# EAGLE design Power_Schematic (EAGLE 6.5.0)
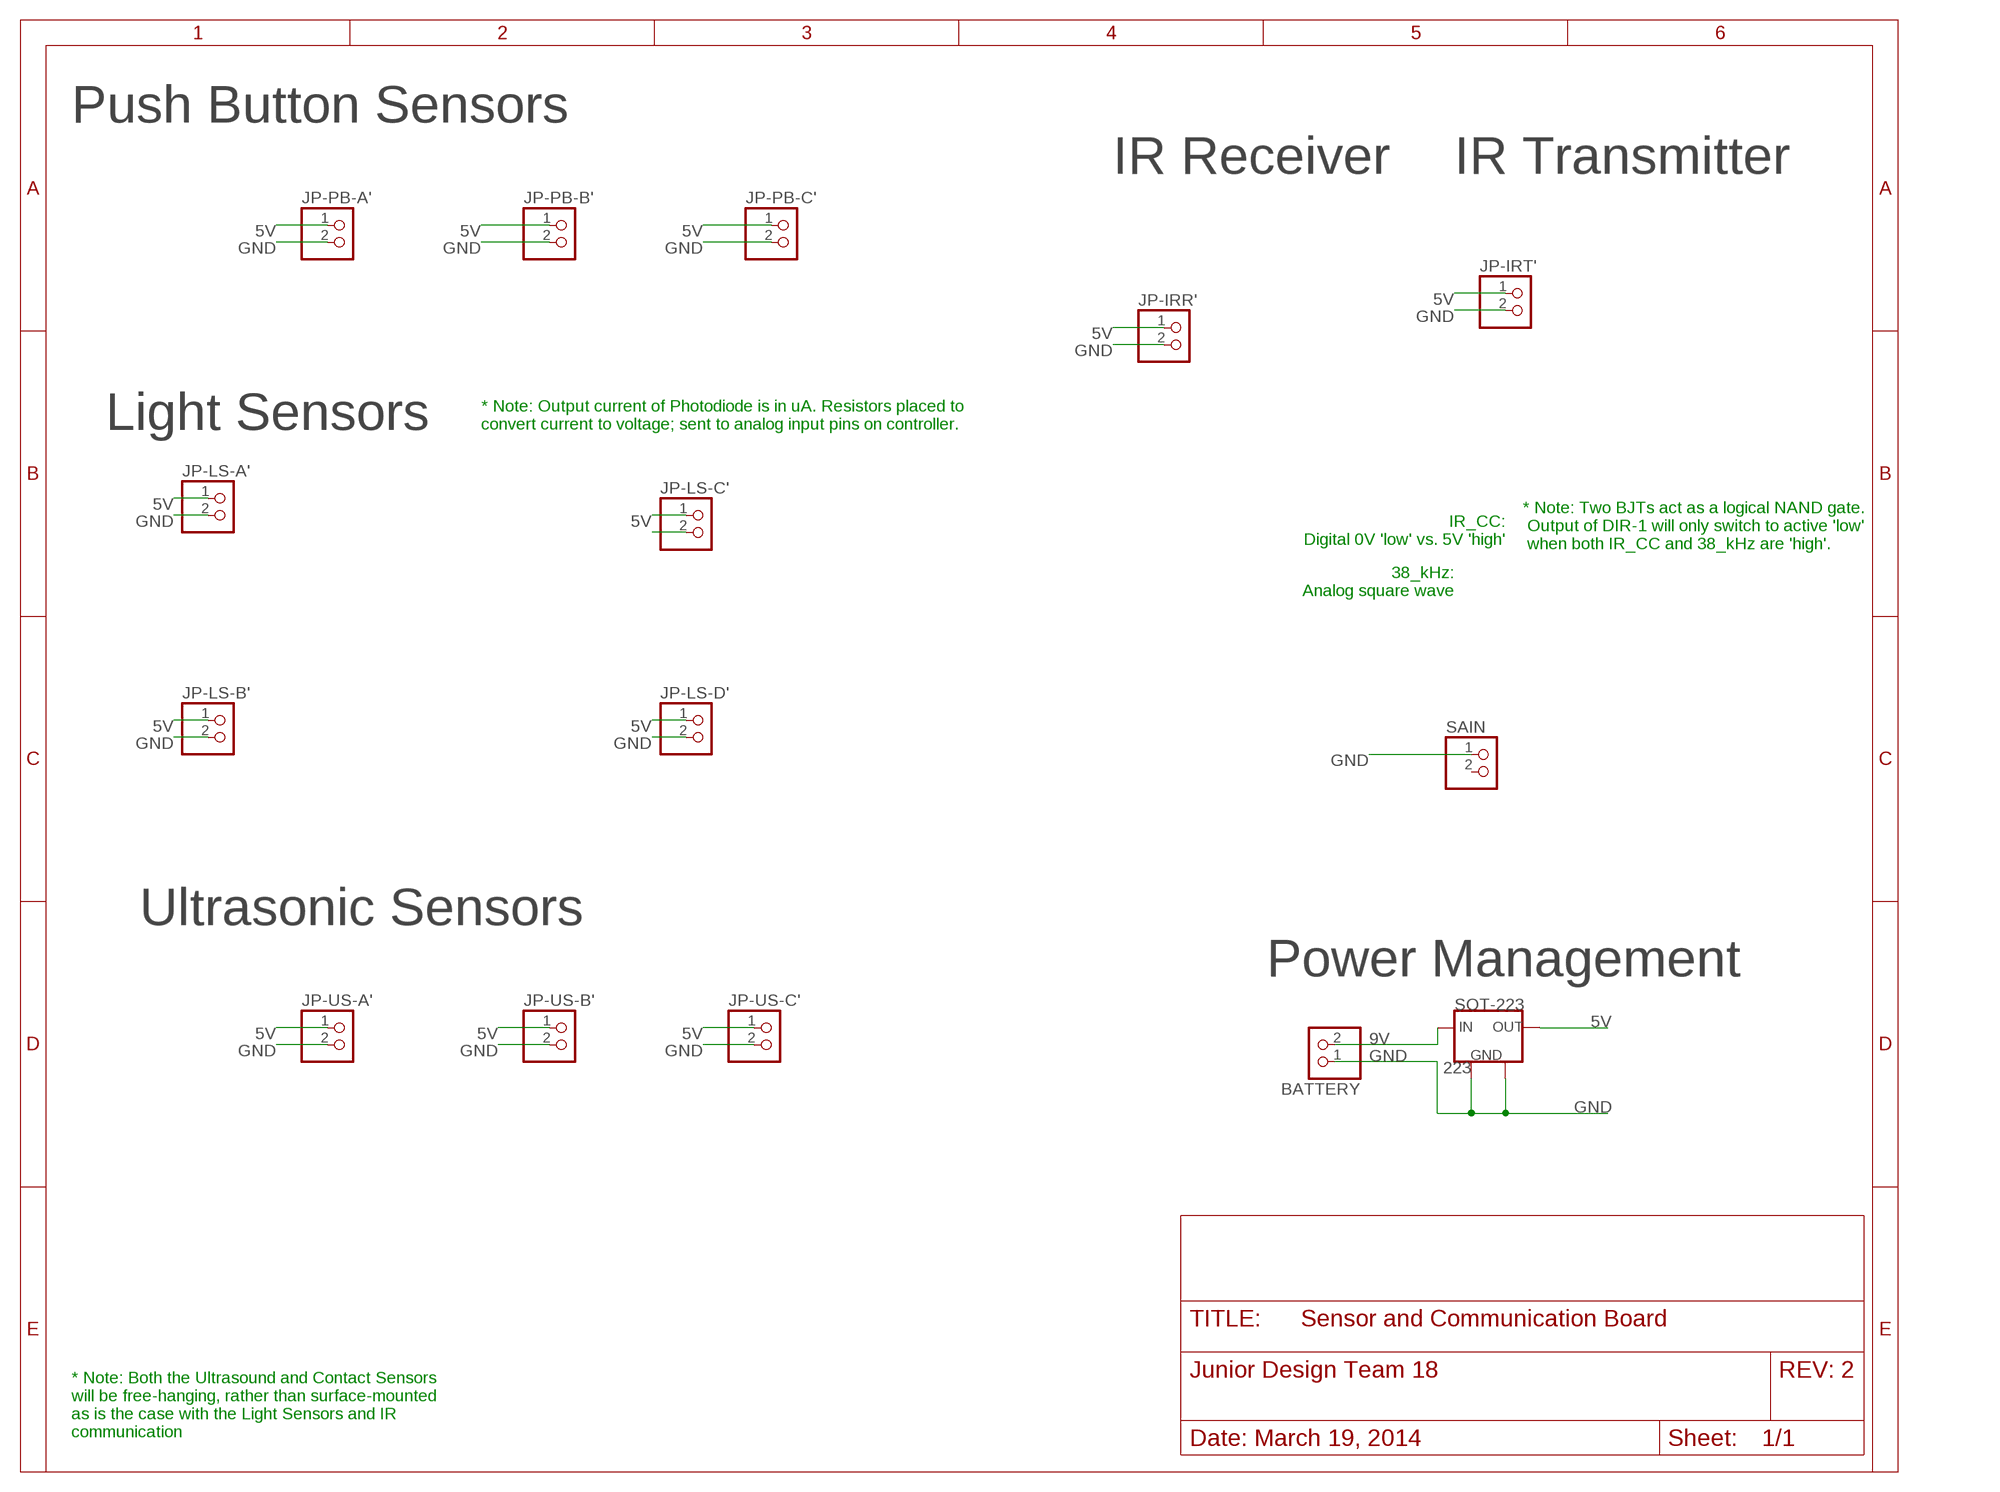
[diagram p0: schematic, sheet 1]

## Parts
BATTERY  PINHD-1X2  [1X02]
JP-IRR'  PINHD-1X2  [1X02]
JP-IRT'  PINHD-1X2  [1X02]
JP-LS-A'  PINHD-1X2  [1X02]
JP-LS-B'  PINHD-1X2  [1X02]
JP-LS-C'  PINHD-1X2  [1X02]
JP-LS-D'  PINHD-1X2  [1X02]
JP-PB-A'  PINHD-1X2  [1X02]
JP-PB-B'  PINHD-1X2  [1X02]
JP-PB-C'  PINHD-1X2  [1X02]
JP-US-A'  PINHD-1X2  [1X02]
JP-US-B'  PINHD-1X2  [1X02]
JP-US-C'  PINHD-1X2  [1X02]
SAIN  PINHD-1X2  [1X02]
SOT-223  223  V_REG_LM1117SOT223  [SOT223]

## Nets
5V: JP-IRR'.1 JP-IRT'.1 JP-LS-A'.1 JP-LS-B'.1 JP-LS-C'.1 JP-LS-D'.1 JP-PB-A'.1 JP-PB-B'.1 JP-PB-C'.1 JP-US-A'.1 JP-US-B'.1 JP-US-C'.1 SOT-223.GND1(OUT)
9V-BAT: BATTERY.2 SOT-223.OUT(IN)
GND: BATTERY.1 JP-IRR'.2 JP-IRT'.2 JP-LS-A'.2 JP-LS-B'.2 JP-LS-C'.2 JP-LS-D'.2 JP-PB-A'.2 JP-PB-B'.2 JP-PB-C'.2 JP-US-A'.2 JP-US-B'.2 JP-US-C'.2 SAIN.1 SOT-223.GND2(GND1) SOT-223.IN(GND2)
Unconnected: SAIN.2

## Notes on the sheet
- Push Button Sensors
- IR Receiver | IR Transmitter
- 5V | 5V | 5V
- GND | GND | GND
- 5V
- GND
- 5V
- GND
- Light Sensors
- * Note: Output current of Photodiode is in uA. Resistors placed to
  convert current to voltage; sent to analog input pins on controller.
- 5V
- GND | 5V
- IR_CC:
  Digital 0V 'low' vs. 5V 'high'
- * Note: Two BJTs act as a logical NAND gate.
   Output of DIR-1 will only switch to active 'low'
   when both IR_CC and 38_kHz are 'high'.
- 38_kHz:
  Analog square wave
- 5V | 5V
- GND | GND
- GND
- Ultrasonic Sensors
- Power Management
- 5V | 5V | 5V | 5V
- GND | GND | GND | 9V
- GND
- GND
- * Note: Both the Ultrasound and Contact Sensors
  will be free-hanging, rather than surface-mounted
  as is the case with the Light Sensors and IR
  communication

## Library data of the parts
BATTERY JP-IRR' JP-IRT' JP-LS-A' JP-LS-B' JP-LS-C' JP-LS-D' JP-PB-A' JP-PB-B' JP-PB-C' JP-US-A' JP-US-B' JP-US-C' SAIN = pinhead:PINHD-1X2: PIN HEADER
SOT-223 = JDT-18:V_REG_LM1117: Voltage Regulator LM1117 Standard adjustable voltage regulator but in SMD form. Spark Fun Electronics SKU : COM-00595

## Net classes
0 default: width 0.152 mm, drill 0.33 mm

## Board
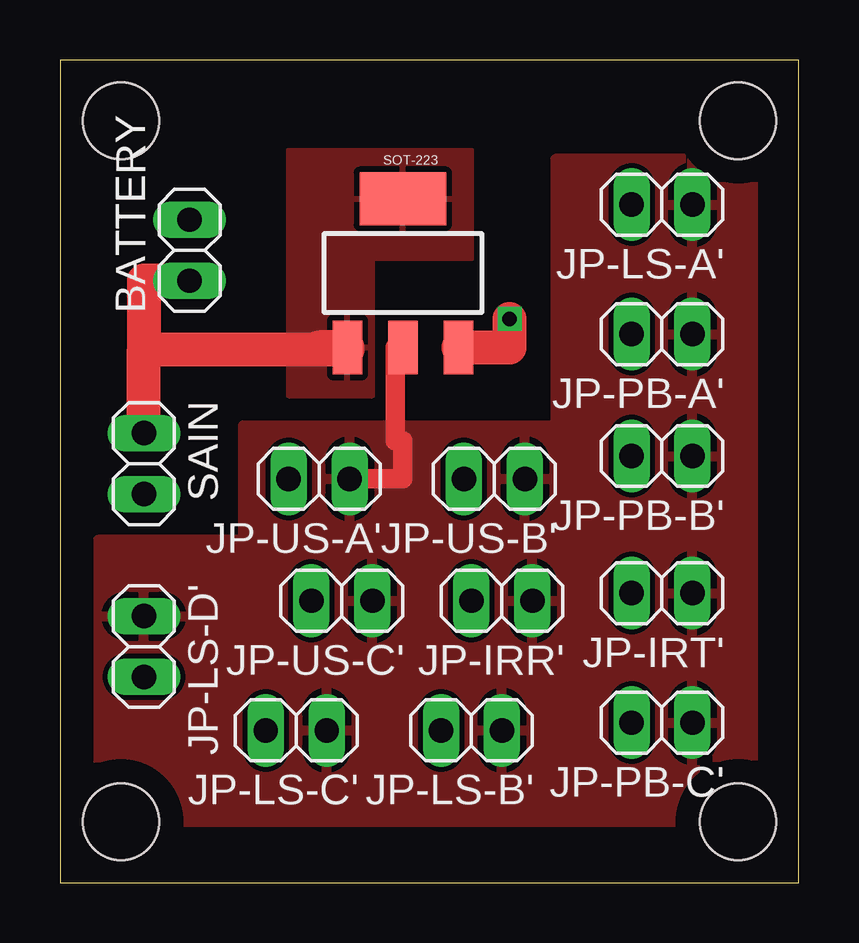
[diagram p1: board, top side]
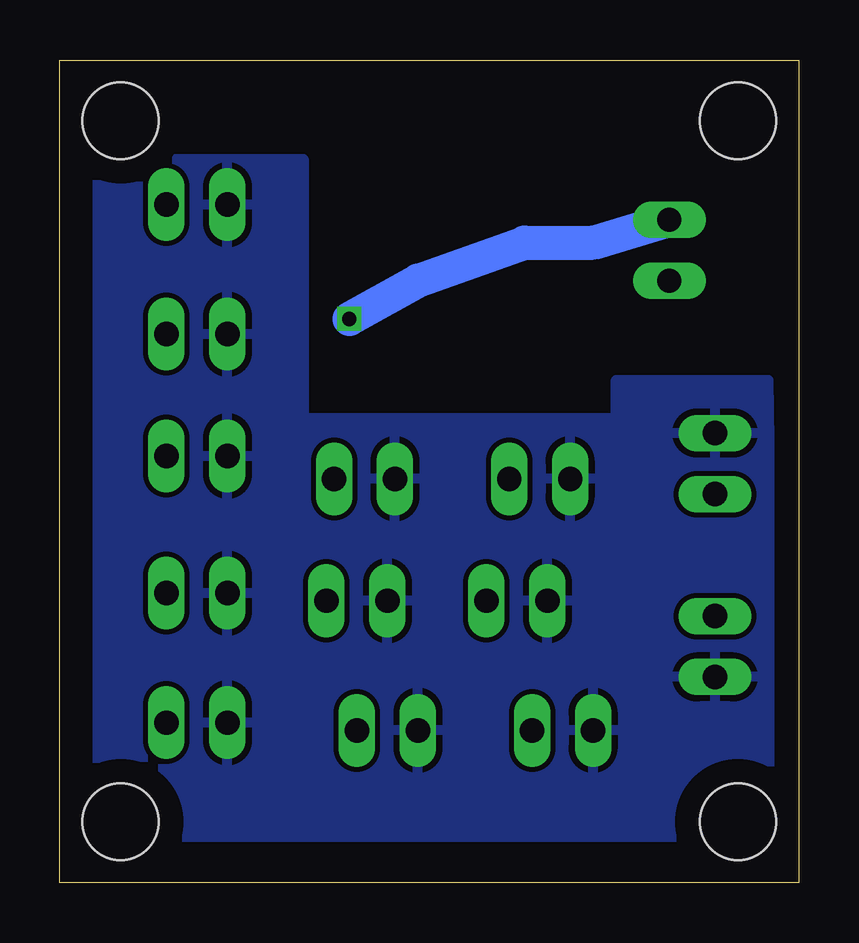
[diagram p2: board, bottom side, seen from below]

Size 30.79 x 34.28 mm. Coordinates in mm from the lower left corner, seen from the top.
Outline: 0,0 30.79,0 30.79,34.28 0,34.28 0,0
Copper layers (1*16): Top 0.035mm / dielectric 1.5mm / Bottom 0.035mm
Design rules "default *": minimum track width 0.001525mm, minimum drill 24mil, track to track 8mil, track to pad 8mil, pad to pad 8mil, via to via 8mil, smd to smd 8mil, copper to edge 40mil, drill to drill 8mil, minimum pad ring 10mil, minimum via ring 8mil, stop-mask expansion 4mil, vias tented up to drill 0mil, thermal gap 10mil
Holes 3.17 mm at 28.26,31.75 28.26,2.54 2.54,31.75 2.54,2.54

### Footprints (pad centres in the part's own frame; a part is rotated, then mirrored left to right if it is on the bottom)
1X02 = drill 1.016 long: 1 -1.27,0; 2 1.27,0
SOT223 = smd 1.219 x 2.235: GND1 0,-3.099; IN -2.311,-3.099; OUT 2.311,-3.099 | smd 3.6 x 2.2: GND2 0,3.099

### Placement (x,y rotation side)
BATTERY  5.4,26.35 90 top
JP-IRR'  18.41,11.75 180 top
JP-IRT'  25.08,12.06 180 top
JP-LS-A'  25.08,28.26 180 top
JP-LS-B'  17.14,6.35 180 top
JP-LS-C'  9.84,6.35 180 top
JP-LS-D'  3.49,9.84 270 top
JP-PB-A'  25.08,22.86 180 top
JP-PB-B'  25.08,17.78 180 top
JP-PB-C'  25.08,6.67 180 top
JP-US-A'  10.79,16.83 180 top
JP-US-B'  18.1,16.83 180 top
JP-US-C'  11.75,11.75 180 top
SAIN  3.49,17.46 270 top
SOT-223  14.29,25.4 0 top

### Tracks (layer width: path | path; a pad name or v marks a point on that pad's centre or on a via)
5V
  Top 0.813: SOT-223.GND1 13.97,22.3 13.97,18.41 14.29,18.41 14.29,16.83 JP-US-A'.1
  pour Top: 20.64,30.16 20.64,19.05 7.62,19.05 7.62,14.29 1.59,14.29 1.59,2.54 28.89,2.54 28.89,30.16
9V-BAT  (via drill 0.6)
  Top 1.422: SOT-223.OUT 18.73,22.3 v18.73,23.5
  Bottom 1.422: v18.73,23.5 15.88,25.08 11.43,26.67 8.57,26.67 BATTERY.2
GND
  Top 0.152: 11.62,22.73 SOT-223.IN
  Top 1.422: SAIN.1 3.49,22.23 | 3.49,22.23 10.79,22.23 | 10.79,22.23 11.98,22.23 | SOT-223.IN 10.79,22.3 10.79,22.23 | BATTERY.1 3.49,25.08 3.49,22.23
  pour Bottom: 20.64,30.16 20.64,19.37 7.62,19.37 7.62,20.95 1.27,20.95 0.95,1.91 29.21,1.91 29.21,30.16
  pour Top: 9.53,30.48 9.53,20.32 13.02,20.32 13.02,26.04 17.14,26.04 17.14,30.48

### Text on the board
tDocu: JD-18-ZF-XZ-KH-V2